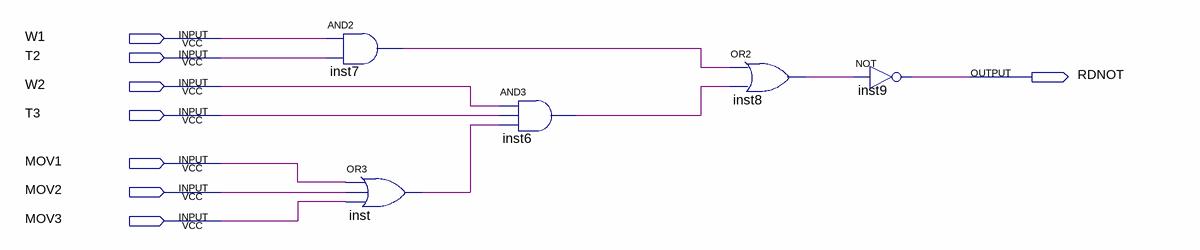
[diagram p0: schematic sheet]
// Quartus schematic RDNOT.bdf as structural Verilog: 5 symbols, 8 pins
module RDNOT (
  input  W1,
  input  T2,
  input  W2,
  input  T3,
  input  MOV1,
  input  MOV2,
  input  MOV3,
  output RDNOT
);

  wire inst6_out, inst7_out, inst8_out, inst_out;

  and inst7 (inst7_out, W1, T2);
  or inst (inst_out, MOV1, MOV2, MOV3);
  and inst6 (inst6_out, W2, T3, inst_out);
  or inst8 (inst8_out, inst7_out, inst6_out);
  not inst9 (RDNOT, inst8_out);
endmodule
